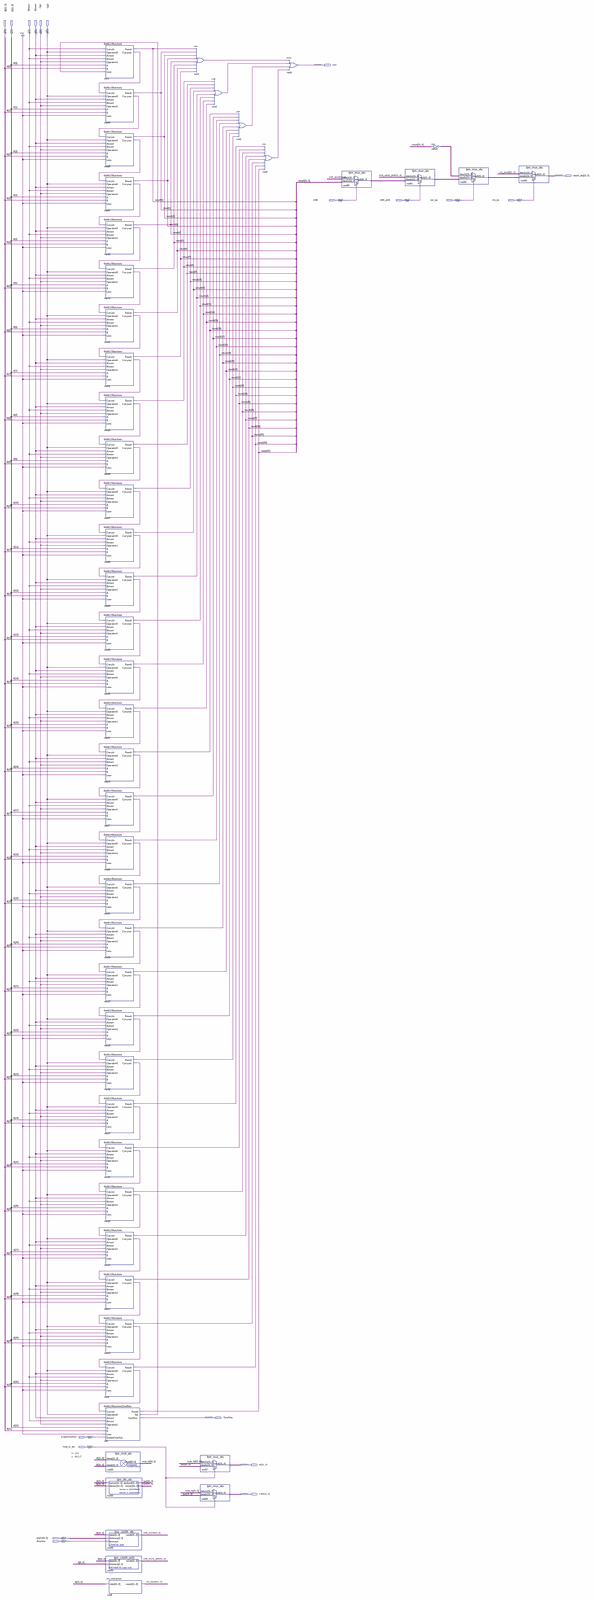
[diagram p0: schematic sheet, whole]
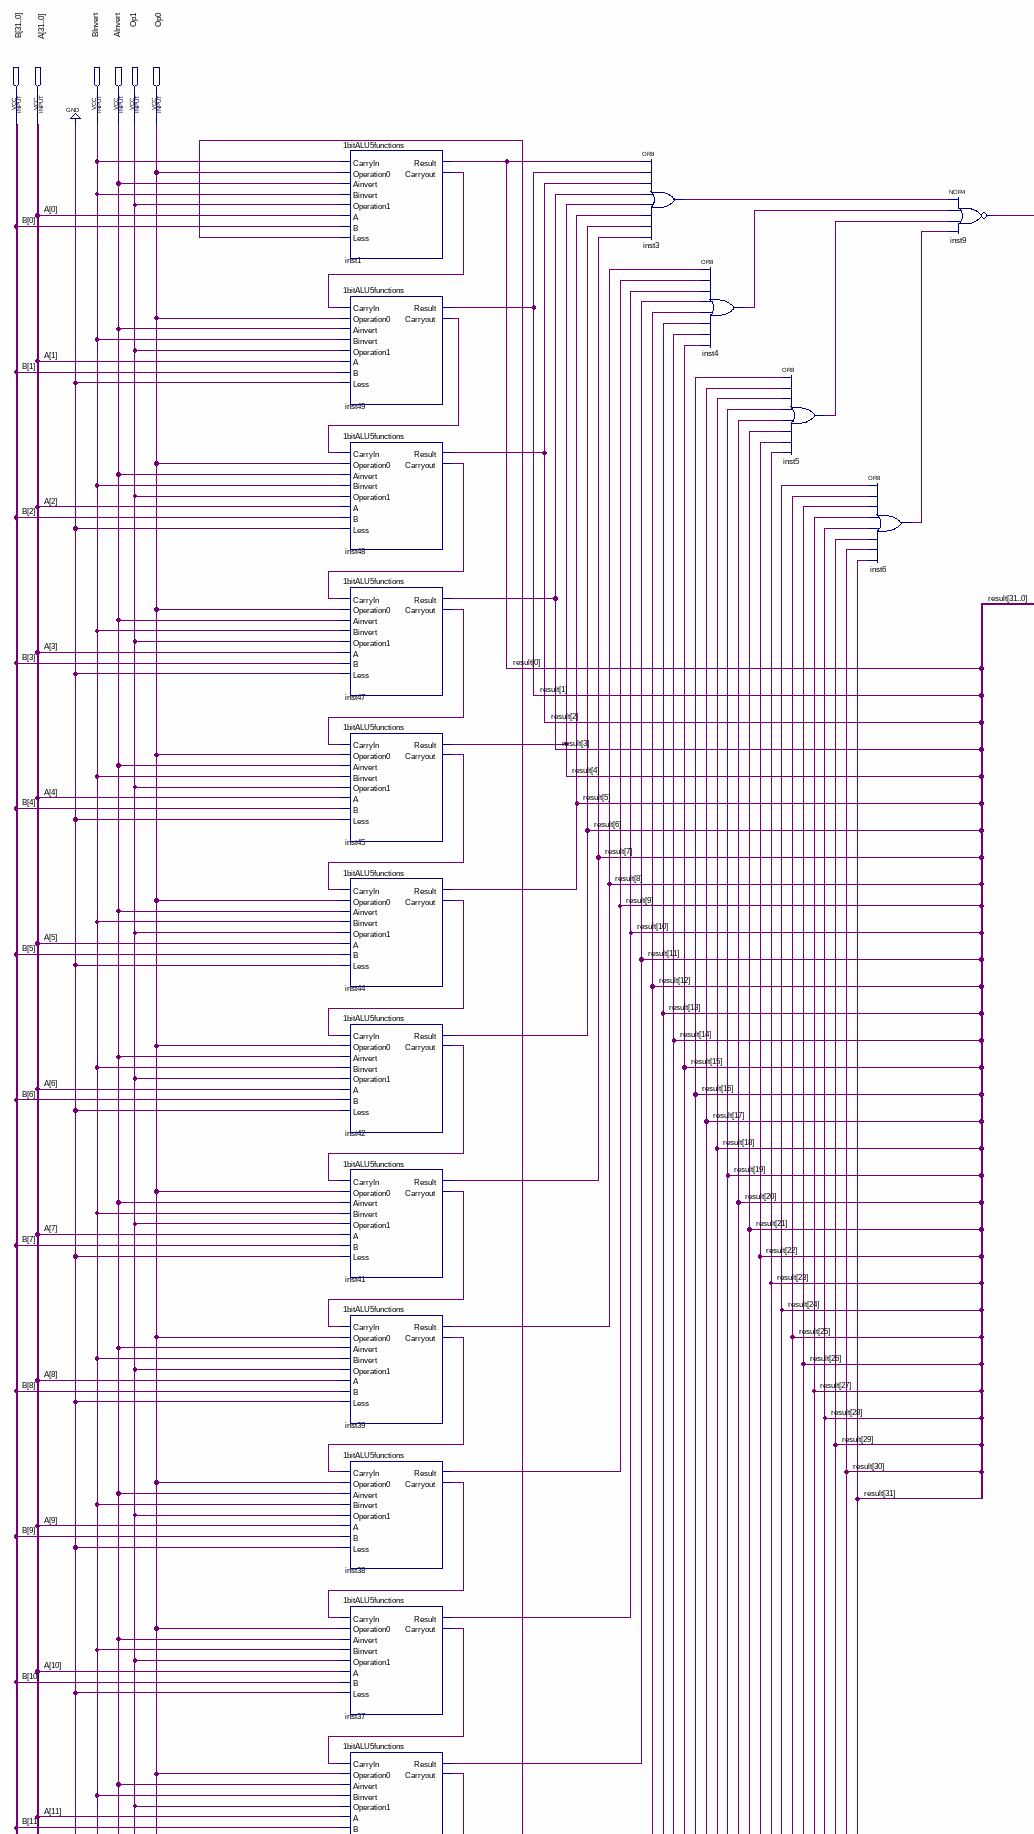
[diagram p1: schematic sheet, upper left part]
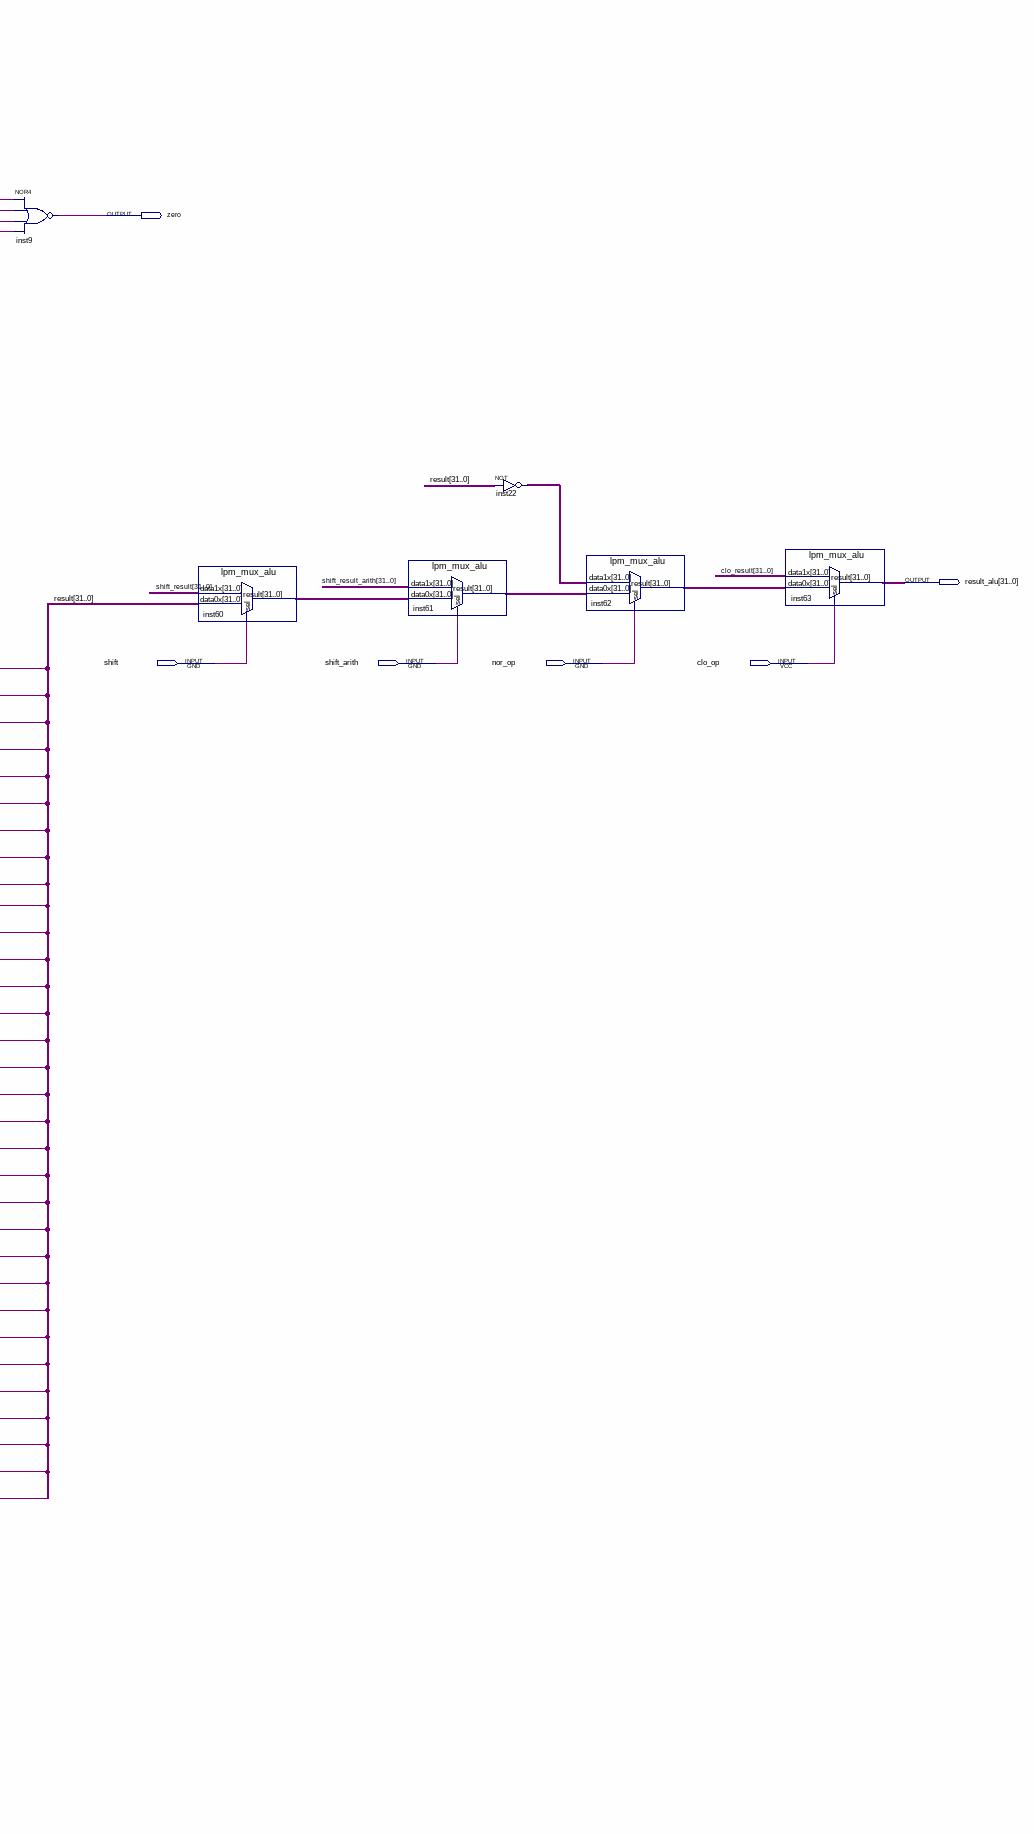
[diagram p2: schematic sheet, upper right part]
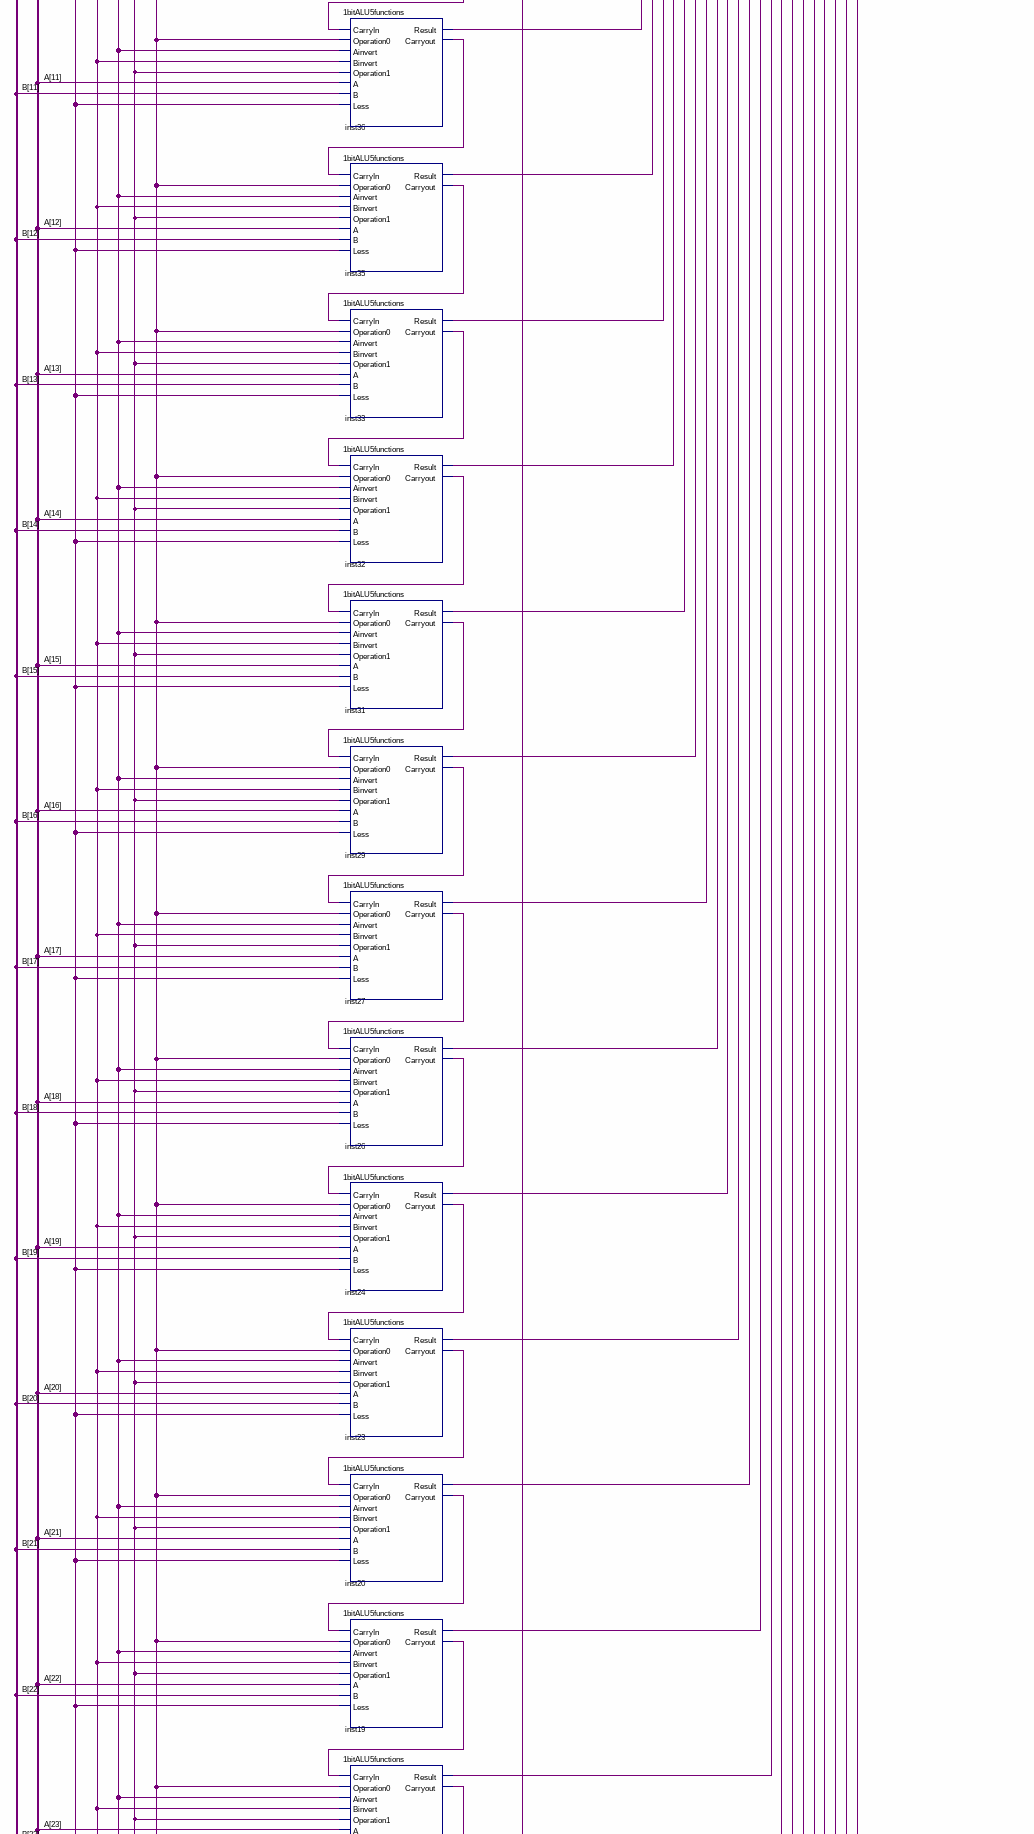
[diagram p3: schematic sheet, middle left part]
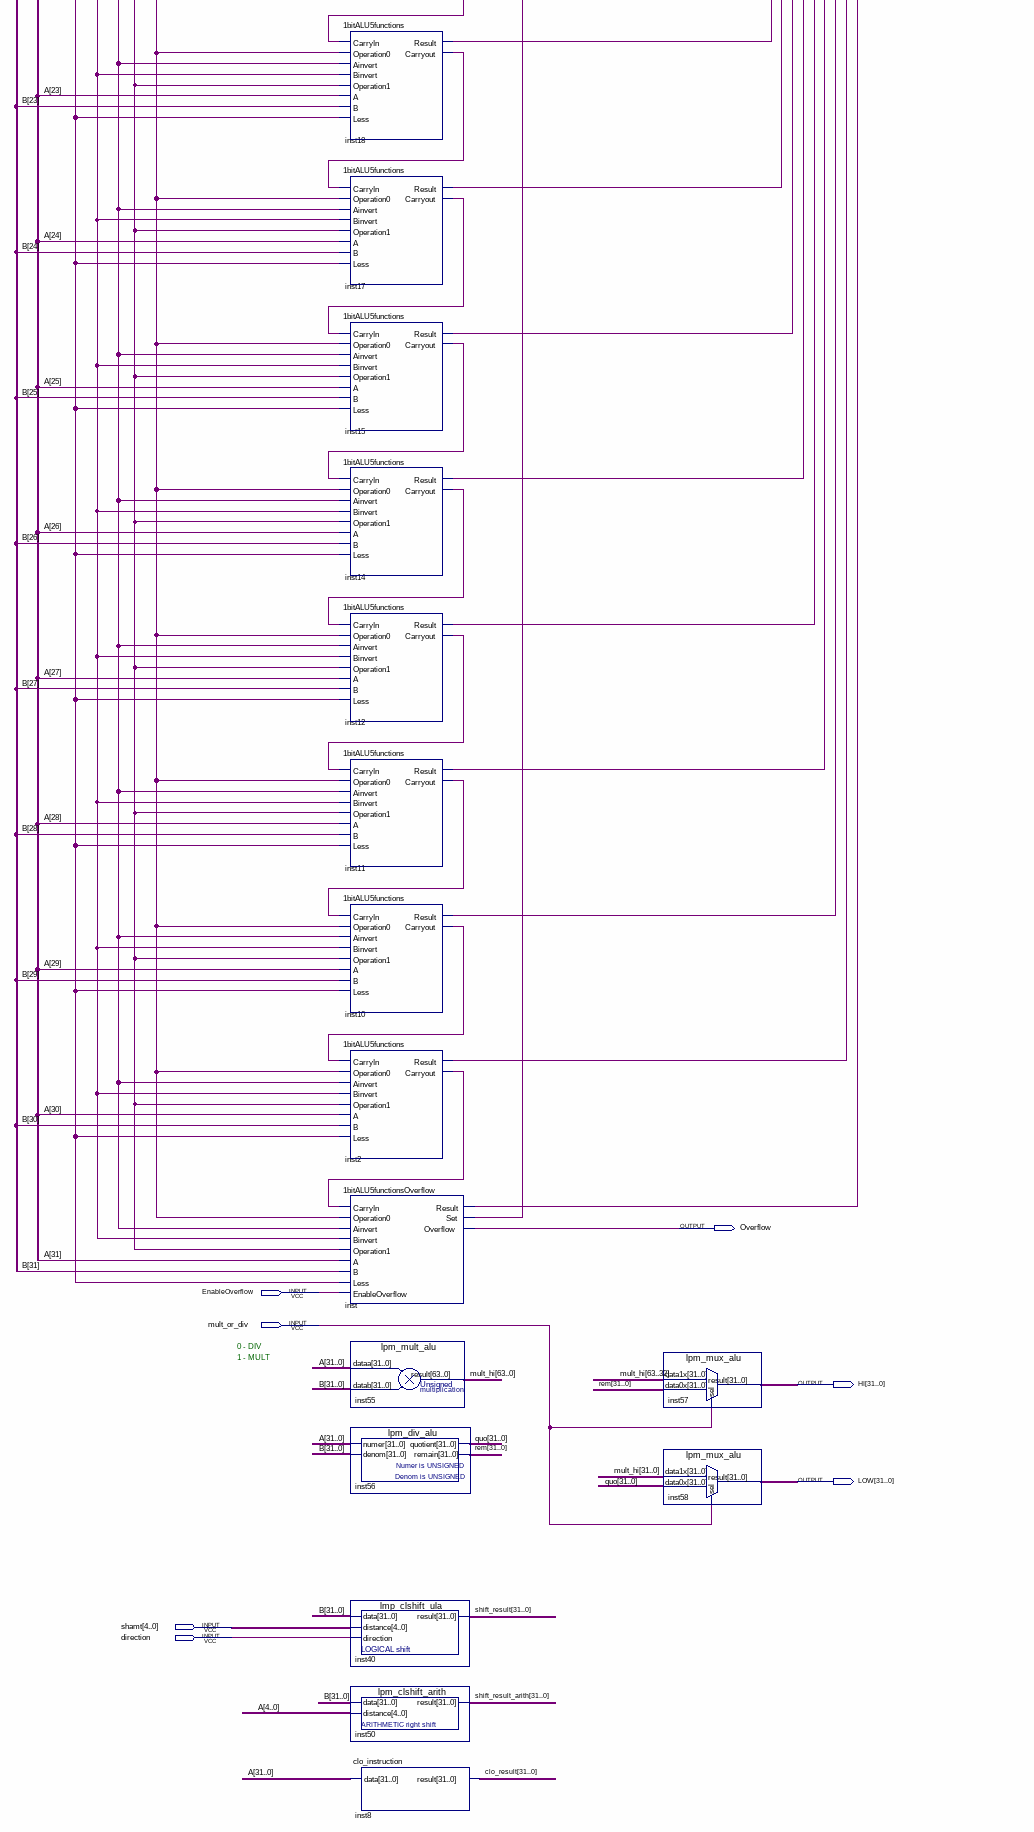
[diagram p4: schematic sheet, lower left part]
// Quartus schematic 32bitULA6funcoes.bdf as structural Verilog: 49 symbols, 19 pins
module \32bitULA6funcoes  (
  input  [31:0] B,
  input  [31:0] A,
  input  BInvert,
  input  AInvert,
  input  Op1,
  input  Op0,
  input  shift,
  input  shift_arith,
  input  nor_op,
  input  clo_op,
  input  EnableOverflow,
  input  mult_or_div,
  input  [4:0] shamt,
  input  direction,
  output zero,
  output [31:0] result_alu,
  output Overflow,
  output [31:0] HI,
  output [31:0] LOW
);

  wire inst1_carryout, inst2_carryout, inst3_out, inst4_out, inst5_out, inst6_out, inst10_carryout,
       inst11_carryout, inst12_carryout, inst14_carryout, inst15_carryout, inst17_carryout, inst18_carryout,
       inst19_carryout, inst20_carryout, inst23_carryout, inst24_carryout, inst26_carryout, inst27_carryout,
       inst29_carryout, inst31_carryout, inst32_carryout, inst33_carryout, inst35_carryout, inst36_carryout,
       inst37_carryout, inst38_carryout, inst39_carryout, inst41_carryout, inst42_carryout, inst44_carryout,
       inst45_carryout, inst47_carryout, inst48_carryout, inst49_carryout, inst_set;
  wire [31:0] clo_result, inst22_out, inst60_result, inst61_result, inst62_result, quo, rem, result,
       shift_result, shift_result_arith;
  wire [63:0] mult_hi;

  \1bitALU5functions  inst1 (
    .CarryIn(BInvert), .Operation0(Op0), .Ainvert(AInvert), .Binvert(BInvert), .Operation1(Op1), .A(A[0]),
    .B(B[0]), .Less(inst_set), .Result(result[0]), .Carryout(inst1_carryout));
  \1bitALU5functions  inst49 (
    .CarryIn(inst1_carryout), .Operation0(Op0), .Ainvert(AInvert), .Binvert(BInvert), .Operation1(Op1),
    .A(A[1]), .B(B[1]), .Less(1'b0), .Result(result[1]), .Carryout(inst49_carryout));
  \1bitALU5functions  inst48 (
    .CarryIn(inst49_carryout), .Operation0(Op0), .Ainvert(AInvert), .Binvert(BInvert), .Operation1(Op1),
    .A(A[2]), .B(B[2]), .Less(1'b0), .Result(result[2]), .Carryout(inst48_carryout));
  \1bitALU5functions  inst47 (
    .CarryIn(inst48_carryout), .Operation0(Op0), .Ainvert(AInvert), .Binvert(BInvert), .Operation1(Op1),
    .A(A[3]), .B(B[3]), .Less(1'b0), .Result(result[3]), .Carryout(inst47_carryout));
  \1bitALU5functions  inst45 (
    .CarryIn(inst47_carryout), .Operation0(Op0), .Ainvert(AInvert), .Binvert(BInvert), .Operation1(Op1),
    .A(A[4]), .B(B[4]), .Less(1'b0), .Result(result[4]), .Carryout(inst45_carryout));
  \1bitALU5functions  inst44 (
    .CarryIn(inst45_carryout), .Operation0(Op0), .Ainvert(AInvert), .Binvert(BInvert), .Operation1(Op1),
    .A(A[5]), .B(B[5]), .Less(1'b0), .Result(result[5]), .Carryout(inst44_carryout));
  \1bitALU5functions  inst42 (
    .CarryIn(inst44_carryout), .Operation0(Op0), .Ainvert(AInvert), .Binvert(BInvert), .Operation1(Op1),
    .A(A[6]), .B(B[6]), .Less(1'b0), .Result(result[6]), .Carryout(inst42_carryout));
  \1bitALU5functions  inst41 (
    .CarryIn(inst42_carryout), .Operation0(Op0), .Ainvert(AInvert), .Binvert(BInvert), .Operation1(Op1),
    .A(A[7]), .B(B[7]), .Less(1'b0), .Result(result[7]), .Carryout(inst41_carryout));
  \1bitALU5functions  inst39 (
    .CarryIn(inst41_carryout), .Operation0(Op0), .Ainvert(AInvert), .Binvert(BInvert), .Operation1(Op1),
    .A(A[8]), .B(B[8]), .Less(1'b0), .Result(result[8]), .Carryout(inst39_carryout));
  \1bitALU5functions  inst38 (
    .CarryIn(inst39_carryout), .Operation0(Op0), .Ainvert(AInvert), .Binvert(BInvert), .Operation1(Op1),
    .A(A[9]), .B(B[9]), .Less(1'b0), .Result(result[9]), .Carryout(inst38_carryout));
  \1bitALU5functions  inst37 (
    .CarryIn(inst38_carryout), .Operation0(Op0), .Ainvert(AInvert), .Binvert(BInvert), .Operation1(Op1),
    .A(A[10]), .B(B[10]), .Less(1'b0), .Result(result[10]), .Carryout(inst37_carryout));
  \1bitALU5functions  inst36 (
    .CarryIn(inst37_carryout), .Operation0(Op0), .Ainvert(AInvert), .Binvert(BInvert), .Operation1(Op1),
    .A(A[11]), .B(B[11]), .Less(1'b0), .Result(result[11]), .Carryout(inst36_carryout));
  \1bitALU5functions  inst35 (
    .CarryIn(inst36_carryout), .Operation0(Op0), .Ainvert(AInvert), .Binvert(BInvert), .Operation1(Op1),
    .A(A[12]), .B(B[12]), .Less(1'b0), .Result(result[12]), .Carryout(inst35_carryout));
  \1bitALU5functions  inst33 (
    .CarryIn(inst35_carryout), .Operation0(Op0), .Ainvert(AInvert), .Binvert(BInvert), .Operation1(Op1),
    .A(A[13]), .B(B[13]), .Less(1'b0), .Result(result[13]), .Carryout(inst33_carryout));
  \1bitALU5functions  inst32 (
    .CarryIn(inst33_carryout), .Operation0(Op0), .Ainvert(AInvert), .Binvert(BInvert), .Operation1(Op1),
    .A(A[14]), .B(B[14]), .Less(1'b0), .Result(result[14]), .Carryout(inst32_carryout));
  \1bitALU5functions  inst31 (
    .CarryIn(inst32_carryout), .Operation0(Op0), .Ainvert(AInvert), .Binvert(BInvert), .Operation1(Op1),
    .A(A[15]), .B(B[15]), .Less(1'b0), .Result(result[15]), .Carryout(inst31_carryout));
  \1bitALU5functions  inst29 (
    .CarryIn(inst31_carryout), .Operation0(Op0), .Ainvert(AInvert), .Binvert(BInvert), .Operation1(Op1),
    .A(A[16]), .B(B[16]), .Less(1'b0), .Result(result[16]), .Carryout(inst29_carryout));
  \1bitALU5functions  inst27 (
    .CarryIn(inst29_carryout), .Operation0(Op0), .Ainvert(AInvert), .Binvert(BInvert), .Operation1(Op1),
    .A(A[17]), .B(B[17]), .Less(1'b0), .Result(result[17]), .Carryout(inst27_carryout));
  \1bitALU5functions  inst26 (
    .CarryIn(inst27_carryout), .Operation0(Op0), .Ainvert(AInvert), .Binvert(BInvert), .Operation1(Op1),
    .A(A[18]), .B(B[18]), .Less(1'b0), .Result(result[18]), .Carryout(inst26_carryout));
  \1bitALU5functions  inst24 (
    .CarryIn(inst26_carryout), .Operation0(Op0), .Ainvert(AInvert), .Binvert(BInvert), .Operation1(Op1),
    .A(A[19]), .B(B[19]), .Less(1'b0), .Result(result[19]), .Carryout(inst24_carryout));
  \1bitALU5functions  inst23 (
    .CarryIn(inst24_carryout), .Operation0(Op0), .Ainvert(AInvert), .Binvert(BInvert), .Operation1(Op1),
    .A(A[20]), .B(B[20]), .Less(1'b0), .Result(result[20]), .Carryout(inst23_carryout));
  \1bitALU5functions  inst20 (
    .CarryIn(inst23_carryout), .Operation0(Op0), .Ainvert(AInvert), .Binvert(BInvert), .Operation1(Op1),
    .A(A[21]), .B(B[21]), .Less(1'b0), .Result(result[21]), .Carryout(inst20_carryout));
  \1bitALU5functions  inst19 (
    .CarryIn(inst20_carryout), .Operation0(Op0), .Ainvert(AInvert), .Binvert(BInvert), .Operation1(Op1),
    .A(A[22]), .B(B[22]), .Less(1'b0), .Result(result[22]), .Carryout(inst19_carryout));
  \1bitALU5functions  inst18 (
    .CarryIn(inst19_carryout), .Operation0(Op0), .Ainvert(AInvert), .Binvert(BInvert), .Operation1(Op1),
    .A(A[23]), .B(B[23]), .Less(1'b0), .Result(result[23]), .Carryout(inst18_carryout));
  \1bitALU5functions  inst17 (
    .CarryIn(inst18_carryout), .Operation0(Op0), .Ainvert(AInvert), .Binvert(BInvert), .Operation1(Op1),
    .A(A[24]), .B(B[24]), .Less(1'b0), .Result(result[24]), .Carryout(inst17_carryout));
  \1bitALU5functions  inst15 (
    .CarryIn(inst17_carryout), .Operation0(Op0), .Ainvert(AInvert), .Binvert(BInvert), .Operation1(Op1),
    .A(A[25]), .B(B[25]), .Less(1'b0), .Result(result[25]), .Carryout(inst15_carryout));
  \1bitALU5functions  inst14 (
    .CarryIn(inst15_carryout), .Operation0(Op0), .Ainvert(AInvert), .Binvert(BInvert), .Operation1(Op1),
    .A(A[26]), .B(B[26]), .Less(1'b0), .Result(result[26]), .Carryout(inst14_carryout));
  \1bitALU5functions  inst12 (
    .CarryIn(inst14_carryout), .Operation0(Op0), .Ainvert(AInvert), .Binvert(BInvert), .Operation1(Op1),
    .A(A[27]), .B(B[27]), .Less(1'b0), .Result(result[27]), .Carryout(inst12_carryout));
  \1bitALU5functions  inst11 (
    .CarryIn(inst12_carryout), .Operation0(Op0), .Ainvert(AInvert), .Binvert(BInvert), .Operation1(Op1),
    .A(A[28]), .B(B[28]), .Less(1'b0), .Result(result[28]), .Carryout(inst11_carryout));
  \1bitALU5functions  inst10 (
    .CarryIn(inst11_carryout), .Operation0(Op0), .Ainvert(AInvert), .Binvert(BInvert), .Operation1(Op1),
    .A(A[29]), .B(B[29]), .Less(1'b0), .Result(result[29]), .Carryout(inst10_carryout));
  \1bitALU5functions  inst2 (
    .CarryIn(inst10_carryout), .Operation0(Op0), .Ainvert(AInvert), .Binvert(BInvert), .Operation1(Op1),
    .A(A[30]), .B(B[30]), .Less(1'b0), .Result(result[30]), .Carryout(inst2_carryout));
  \1bitALU5functionsOverflow  inst (
    .CarryIn(inst2_carryout), .Operation0(Op0), .Ainvert(AInvert), .Binvert(BInvert), .Operation1(Op1),
    .A(A[31]), .B(B[31]), .Less(1'b0), .EnableOverflow(EnableOverflow), .Result(result[31]), .Set(inst_set),
    .Overflow(Overflow));
  lpm_mult_alu inst55 (.dataa(A), .datab(B), .result(mult_hi));
  lpm_div_alu inst56 (.numer(A), .denom(B), .quotient(quo), .remain(rem));
  lmp_clshift_ula inst40 (.data(B), .distance(shamt), .direction(direction), .result(shift_result));
  lpm_clshift_arith inst50 (.data(B), .distance(A[4:0]), .result(shift_result_arith));
  clo_instruction inst8 (.data(A), .result(clo_result));
  or inst3 (inst3_out, result[0], result[1], result[2], result[3], result[4], result[5], result[6], result[7]);
  or inst4 (inst4_out, result[8], result[9], result[10], result[11], result[12], result[13], result[14], result[15]);
  lpm_mux_alu inst57 (.data1x(mult_hi[63:32]), .data0x(rem), .sel(mult_or_div), .result(HI));
  lpm_mux_alu inst58 (.data1x(mult_hi[31:0]), .data0x(quo), .sel(mult_or_div), .result(LOW));
  or inst5 (inst5_out, result[16], result[17], result[18], result[19], result[20], result[21], result[22], result[23]);
  or inst6 (inst6_out, result[24], result[25], result[26], result[27], result[28], result[29], result[30], result[31]);
  nor inst9 (zero, inst3_out, inst4_out, inst5_out, inst6_out);
  lpm_mux_alu inst60 (.data1x(shift_result), .data0x(result), .sel(shift), .result(inst60_result));
  lpm_mux_alu inst61 (.data1x(shift_result_arith), .data0x(inst60_result), .sel(shift_arith), .result(inst61_result));
  assign inst22_out = ~result;  // NOT inst22, 32 bits wide
  lpm_mux_alu inst62 (.data1x(inst22_out), .data0x(inst61_result), .sel(nor_op), .result(inst62_result));
  lpm_mux_alu inst63 (.data1x(clo_result), .data0x(inst62_result), .sel(clo_op), .result(result_alu));

  // Notes on the sheet:
  //   0 - DIV
  //   1 - MULT
endmodule
